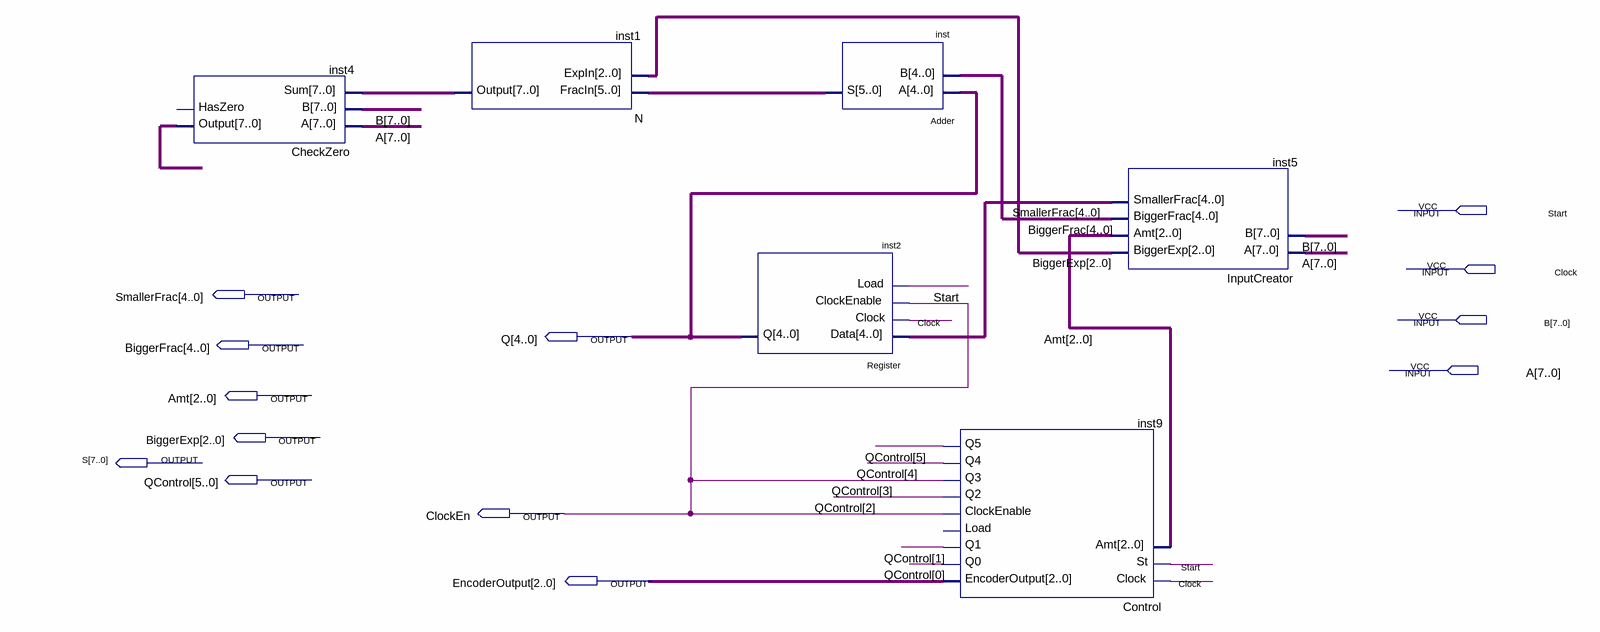
[diagram p0: schematic sheet]
// Quartus schematic L_Adder.bdf as structural Verilog: 6 symbols, 13 pins
module L_Adder (
  input  Start,
  input  Clock,
  input  [7:0] B,
  input  [7:0] A,
  output [4:0] SmallerFrac,
  output [4:0] Q,
  output [4:0] BiggerFrac,
  output [2:0] Amt,
  output [2:0] BiggerExp,
  output [7:0] S,
  output [5:0] QControl,
  output ClockEn,
  output [2:0] EncoderOutput
);

  wire [5:0] inst_s;
  wire [7:0] inst1_output, inst4_output;

  CheckZero inst4 (.A(A), .B(B), .Sum(inst1_output), .Output(inst4_output));  // open: HasZero
  N inst1 (.FracIn(inst_s), .ExpIn(BiggerExp), .Output(inst1_output));
  Register inst2 (.Data(SmallerFrac), .Clock(Clock), .ClockEnable(ClockEn), .Load(Start), .Q(Q));
  Adder inst (.A(Q), .B(BiggerFrac), .S(inst_s));
  Control inst9 (
    .Clock(Clock), .St(Start), .Amt(Amt), .EncoderOutput(EncoderOutput), .Q0(QControl[0]), .Q1(QControl[1]),
    .ClockEnable(ClockEn), .Q2(QControl[2]), .Q3(ClockEn), .Q4(QControl[4]), .Q5(QControl[5]));  // open: Load
  InputCreator inst5 (
    .A(A), .B(B), .BiggerExp(BiggerExp), .Amt(Amt), .BiggerFrac(BiggerFrac), .SmallerFrac(SmallerFrac));

  assign QControl[3] = ClockEn;
endmodule
